# EAGLE design buck_converters_v1.1 (EAGLE 9.6.2)

## Sheet 1 of 2
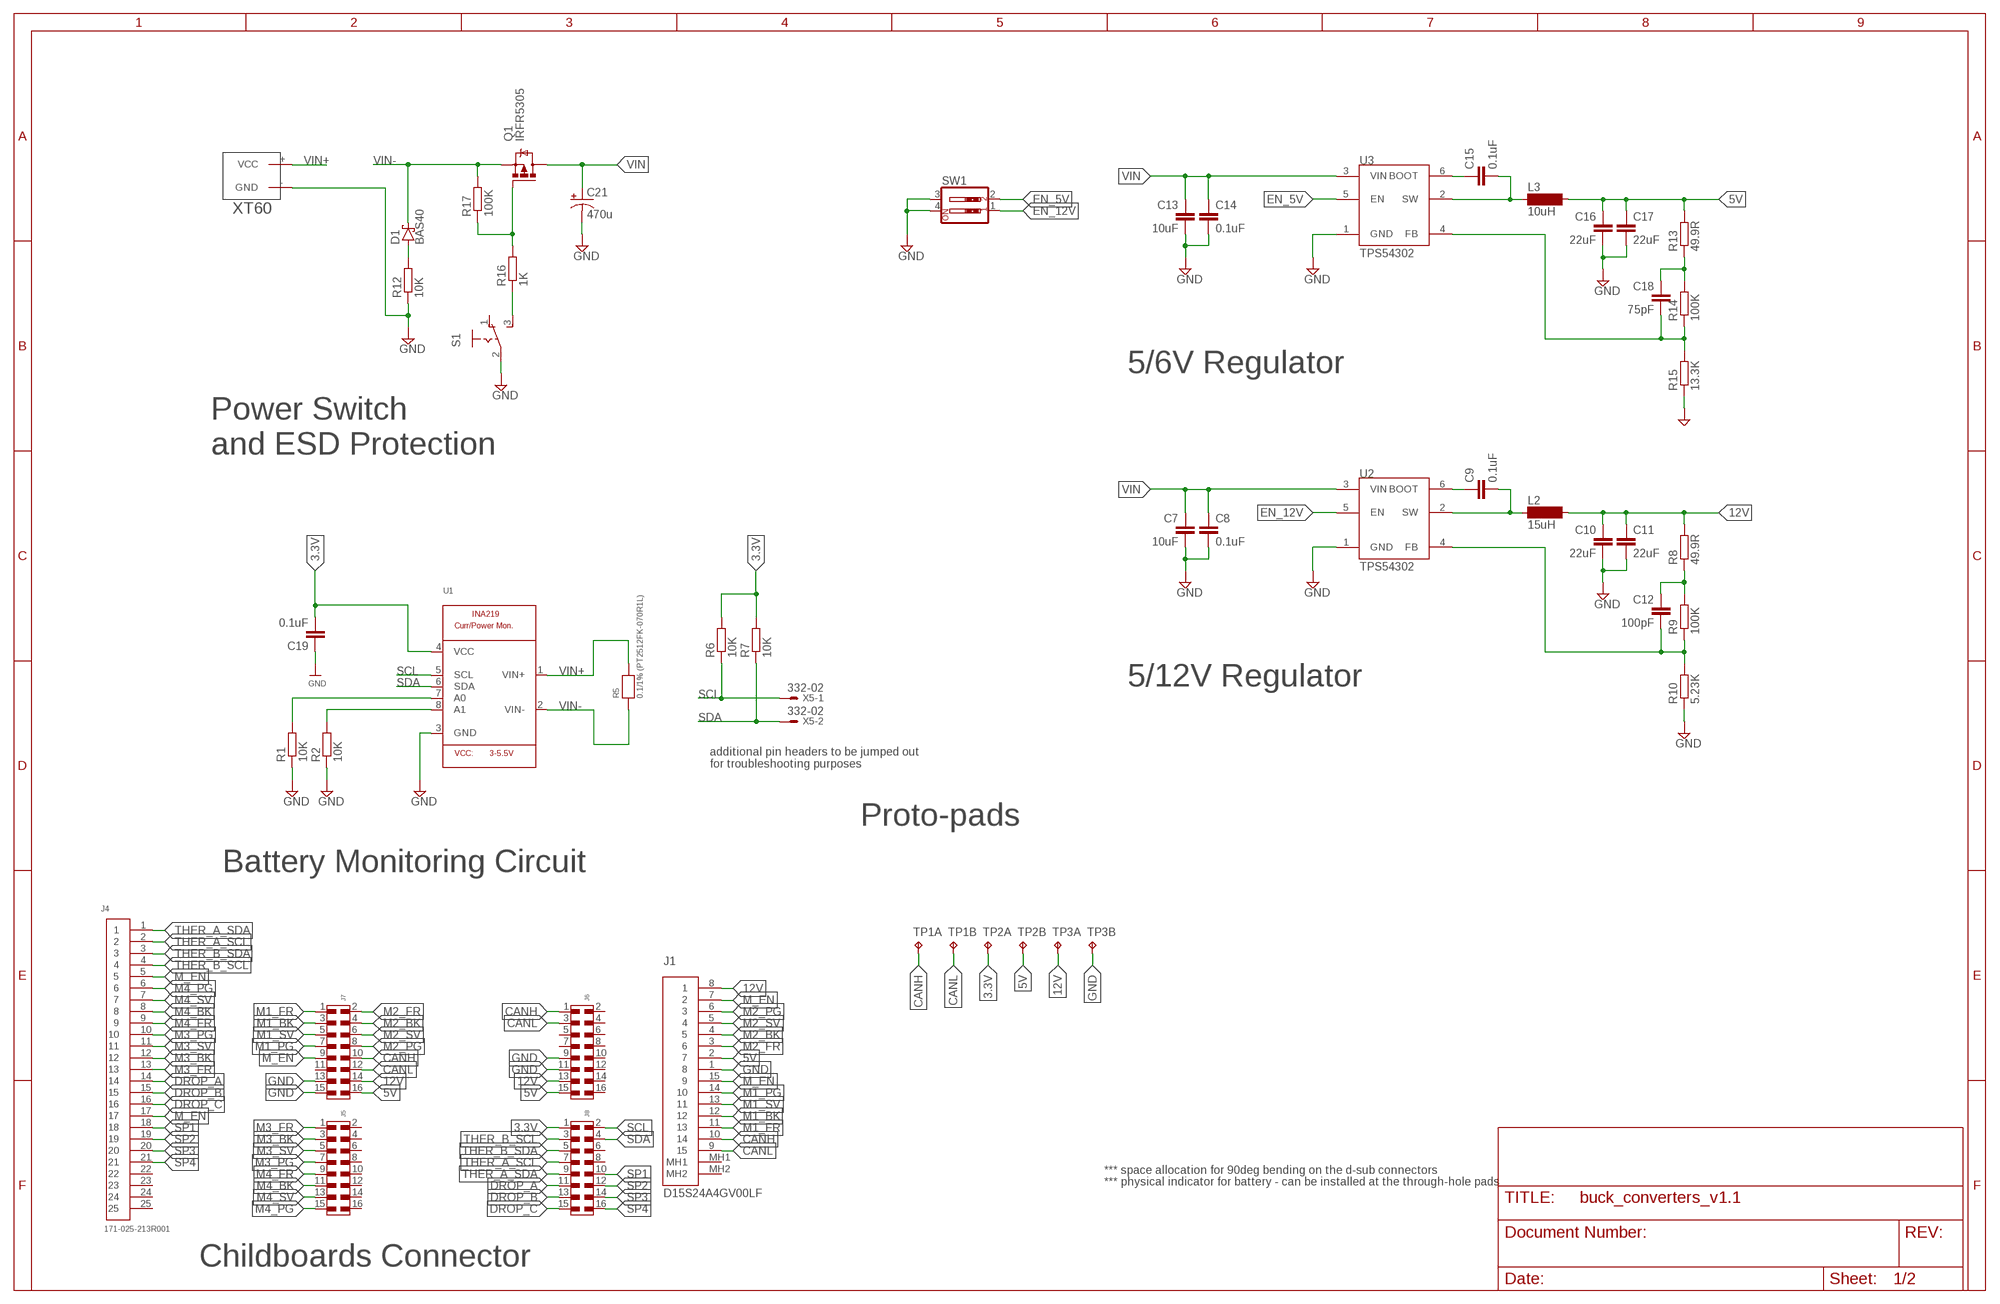
[diagram p0: schematic, sheet 1]

### Parts
C7  10uF  C-EUC0805  [C0805]
C8  0.1uF  C-EUC0805  [C0805]
C9  0.1uF  C-EUC0805  [C0805]
C10  22uF  C-EUC0805  [C0805]
C11  22uF  C-EUC0805  [C0805]
C12  100pF  C-EUC0805  [C0805]
C13  10uF  C-EUC0805  [C0805]
C14  0.1uF  C-EUC0805  [C0805]
C15  0.1uF  C-EUC0805  [C0805]
C16  22uF  C-EUC0805  [C0805]
C17  22uF  C-EUC0805  [C0805]
C18  75pF  C-EUC0805  [C0805]
C19  0.1uF  C-EUC0805  [C0805]
C21  470u  CPOL-US153CLV-1010  [153CLV-1010]
D1  BAS40  [SOT23]
J1  D15S24A4GV00LF  [D15S24A4GV00LF]
J4  171-025-213R001  [171-025-213R001]
J5  6120XX20621_61201620621  [61201620621]
J6  6120XX20621_61201620621  [61201620621]
J7  6123XX20621_61231620621  [61231620621]
J8  6120XX20621_61201620621  [61201620621]
L2  15uH  SM-NE29  [SM-NE29]
L3  10uH  SM-NE29  [SM-NE29]
Q1  IRFR5305  [D-PAK_TO252AA]
R1  10K  R-EU_R0805  [R0805]
R2  10K  R-EU_R0805  [R0805]
R5  0.1/1% (PT2512FK-070R1L)  RESISTOR2512  [2512]
R6  10K  R-EU_R0805  [R0805]
R7  10K  R-EU_R0805  [R0805]
R8  49.9R  R-EU_R0805  [R0805]
R9  100K  R-EU_R0805  [R0805]
R10  5.23K  R-EU_R0805  [R0805]
R12  10K  R-EU_R0805  [R0805]
R13  49.9R  R-EU_R0805  [R0805]
R14  100K  R-EU_R0805  [R0805]
R15  13.3K  R-EU_R0805  [R0805]
R16  1K  R-EU_R0805  [R0805]
R17  100K  R-EU_R0805  [R0805]
S1  255SB  [255SB]
SW1  SW_DIP-2  [EDG-02]
TP1  TP2P2-38-17  [P2-38-17]
TP2  TP2P2-38-17  [P2-38-17]
TP3  TP2P2-38-17  [P2-38-17]
U1  INA219  [SOT23-8]
U2  TPS54302  [SOT23-6]
U3  TPS54302  [SOT23-6]
U$9  XT60  [XT60]
X5  332-02  [332-02]

### Nets
3.3V: C19.2 J8.1 R6.2 R7.2 TP2.TP-1 U1.4(VCC) ; also sheet 2
5V: C16.1 C17.1 J1.2 J6.15 J7.16 L3.2 R13.2 TP2.TP-2 ; also sheet 2
12V: C10.1 C11.1 J1.8 J6.13 J7.14 L2.2 R8.2 TP3.TP-1 ; also sheet 2
CANH: J1.10 J6.1 J7.10 TP1.TP-1 ; also sheet 2
CANL: J1.9 J6.3 J7.12 TP1.TP-2 ; also sheet 2
DROP_A: J4.14 J8.11 ; also sheet 2
DROP_B: J4.15 J8.13 ; also sheet 2
DROP_C: J4.16 J8.15 ; also sheet 2
EN_5V: SW1.2 U3.5(EN)
EN_12V: SW1.1 U2.5(EN)
GND: C7.2 C8.2 C10.2 C11.2 C13.2 C14.2 C16.2 C17.2 C19.1 C21.- J1.1 J6.9 J6.11 J7.13 J7.15 R1.1 R2.1 R10.1 R12.1 R15.1 S1.2(P) SW1.3 SW1.4 TP3.TP-2 U1.3(GND) U2.1(GND) U3.1(GND) U$9.-(GND) ; also sheet 2
M1_BK: J1.12 J7.3 ; also sheet 2
M1_FR: J1.11 J7.1 ; also sheet 2
M1_PG: J1.14 J7.7 ; also sheet 2
M1_SV: J1.13 J7.5 ; also sheet 2
M2_BK: J1.4 J7.4 ; also sheet 2
M2_FR: J1.3 J7.2 ; also sheet 2
M2_PG: J1.6 J7.8 ; also sheet 2
M2_SV: J1.5 J7.6 ; also sheet 2
M3_BK: J4.12 J5.3 ; also sheet 2
M3_FR: J4.13 J5.1 ; also sheet 2
M3_PG: J4.10 J5.7 ; also sheet 2
M3_SV: J4.11 J5.5 ; also sheet 2
M4_BK: J4.8 J5.11 ; also sheet 2
M4_FR: J4.9 J5.9 ; also sheet 2
M4_PG: J4.6 J5.15 ; also sheet 2
M4_SV: J4.7 J5.13 ; also sheet 2
M_EN: J1.7 J1.15 J4.5 J4.17 J7.9 ; also sheet 2
N$3: R2.2 U1.8(A1)
N$6: C12.1 R8.1 R9.2
N$7: C12.2 R9.1 R10.2 U2.4(FB)
N$8: R1.2 U1.7(A0)
N$9: C9.1 U2.6(BOOT)
N$10: C9.2 L2.1 U2.2(SW)
N$11: C18.1 R13.1 R14.2
N$12: C18.2 R14.1 R15.2 U3.4(FB)
N$14: C15.1 U3.6(BOOT)
N$15: C15.2 L3.1 U3.2(SW)
N$16: D1.1(A) R12.2
N$17: R16.1 S1.3(S)
N$18: Q1.1(G) R16.2 R17.1
SCL: J8.2 R6.1 U1.5(SCL) X5.1 ; also sheet 2
SDA: J8.4 R7.1 U1.6(SDA) X5.2 ; also sheet 2
SP1: J4.18 J8.10 ; also sheet 2
SP2: J4.19 J8.12 ; also sheet 2
SP3: J4.20 J8.14 ; also sheet 2
SP4: J4.21 J8.16 ; also sheet 2
THER_A_SCL: J4.2 J8.7 ; also sheet 2
THER_A_SDA: J4.1 J8.9 ; also sheet 2
THER_B_SCL: J4.4 J8.3 ; also sheet 2
THER_B_SDA: J4.3 J8.5 ; also sheet 2
VIN: C7.1 C8.1 C13.1 C14.1 C21.+ Q1.4(D) U2.3(VIN) U3.3(VIN)
VIN+: R5.2 U1.1(VIN+) U$9.+(VCC)
VIN-: D1.3(C) Q1.3(S) R5.1 R17.2 U1.2(VIN-)
Unconnected: J1.MH1 J1.MH2 J4.22 J4.23 J4.24 J4.25 J5.2 J5.4 J5.6 J5.8 J5.10 J5.12 J5.14 J5.16 J6.2 J6.4 J6.5 J6.6 J6.7 J6.8 J6.10 J6.12 J6.14 J6.16 J7.11 J8.6 J8.8 S1.1(O)

### Notes on the sheet
- 5/6V Regulator
- Power Switch
  and ESD Protection
- 5/12V Regulator
- additional pin headers to be jumped out 
  for troubleshooting purposes
- Proto-pads
- Battery Monitoring Circuit
- *** space allocation for 90deg bending on the d-sub connectors
- *** physical indicator for battery - can be installed at the through-hole pads
- Childboards Connector

## Sheet 2 of 2
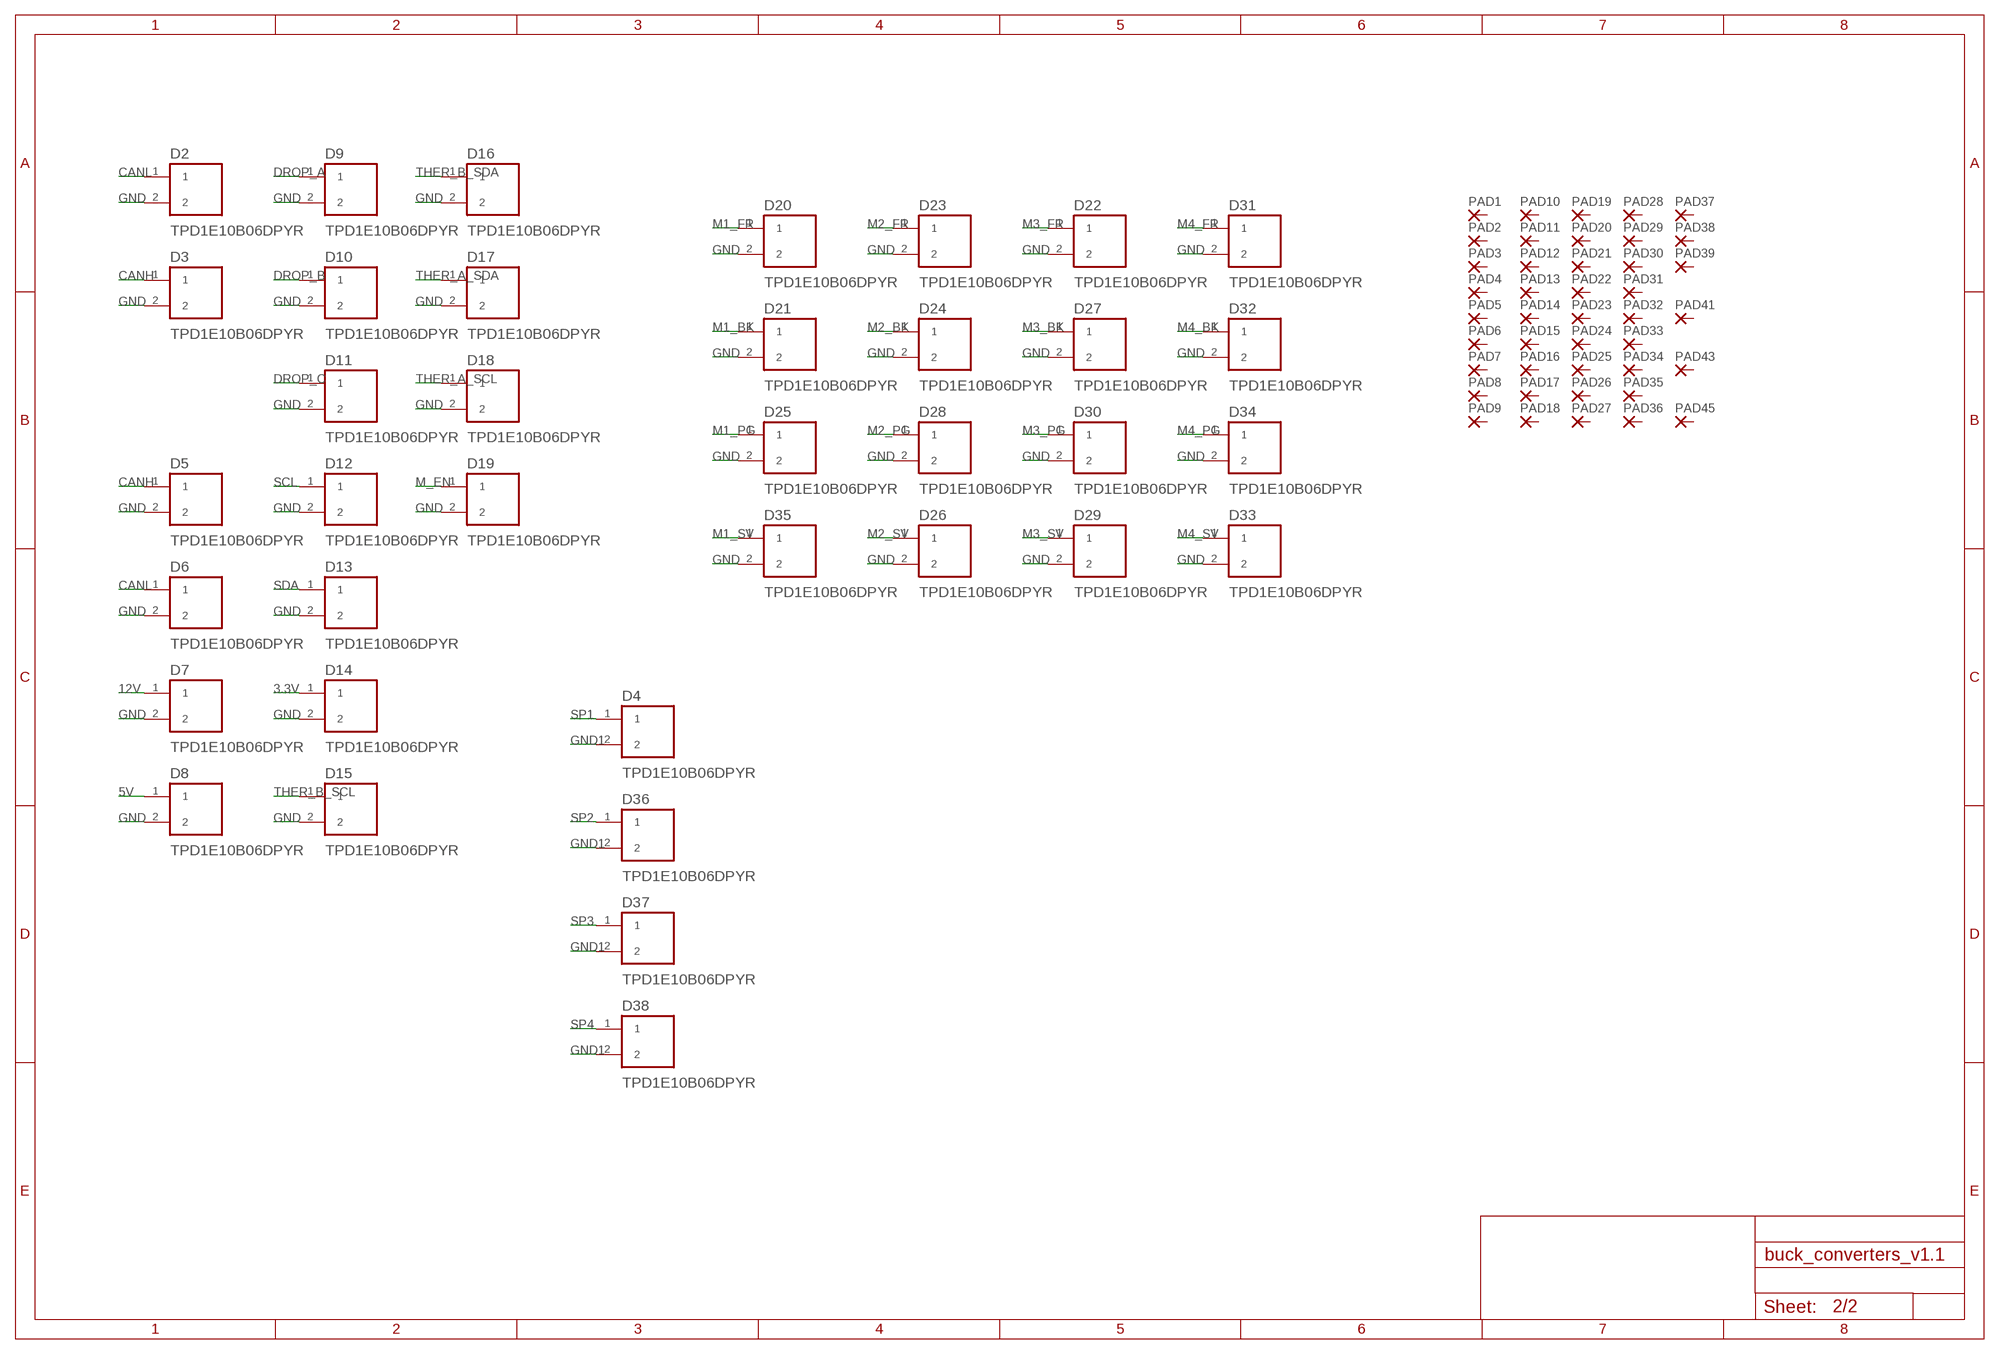
[diagram p1: schematic, sheet 2]

### Parts
D2  TPD1E10B06DPYR  [DIO_TPD1E05U06DPYR]
D3  TPD1E10B06DPYR  [DIO_TPD1E05U06DPYR]
D4  TPD1E10B06DPYR  [DIO_TPD1E05U06DPYR]
D5  TPD1E10B06DPYR  [DIO_TPD1E05U06DPYR]
D6  TPD1E10B06DPYR  [DIO_TPD1E05U06DPYR]
D7  TPD1E10B06DPYR  [DIO_TPD1E05U06DPYR]
D8  TPD1E10B06DPYR  [DIO_TPD1E05U06DPYR]
D9  TPD1E10B06DPYR  [DIO_TPD1E05U06DPYR]
D10  TPD1E10B06DPYR  [DIO_TPD1E05U06DPYR]
D11  TPD1E10B06DPYR  [DIO_TPD1E05U06DPYR]
D12  TPD1E10B06DPYR  [DIO_TPD1E05U06DPYR]
D13  TPD1E10B06DPYR  [DIO_TPD1E05U06DPYR]
D14  TPD1E10B06DPYR  [DIO_TPD1E05U06DPYR]
D15  TPD1E10B06DPYR  [DIO_TPD1E05U06DPYR]
D16  TPD1E10B06DPYR  [DIO_TPD1E05U06DPYR]
D17  TPD1E10B06DPYR  [DIO_TPD1E05U06DPYR]
D18  TPD1E10B06DPYR  [DIO_TPD1E05U06DPYR]
D19  TPD1E10B06DPYR  [DIO_TPD1E05U06DPYR]
D20  TPD1E10B06DPYR  [DIO_TPD1E05U06DPYR]
D21  TPD1E10B06DPYR  [DIO_TPD1E05U06DPYR]
D22  TPD1E10B06DPYR  [DIO_TPD1E05U06DPYR]
D23  TPD1E10B06DPYR  [DIO_TPD1E05U06DPYR]
D24  TPD1E10B06DPYR  [DIO_TPD1E05U06DPYR]
D25  TPD1E10B06DPYR  [DIO_TPD1E05U06DPYR]
D26  TPD1E10B06DPYR  [DIO_TPD1E05U06DPYR]
D27  TPD1E10B06DPYR  [DIO_TPD1E05U06DPYR]
D28  TPD1E10B06DPYR  [DIO_TPD1E05U06DPYR]
D29  TPD1E10B06DPYR  [DIO_TPD1E05U06DPYR]
D30  TPD1E10B06DPYR  [DIO_TPD1E05U06DPYR]
D31  TPD1E10B06DPYR  [DIO_TPD1E05U06DPYR]
D32  TPD1E10B06DPYR  [DIO_TPD1E05U06DPYR]
D33  TPD1E10B06DPYR  [DIO_TPD1E05U06DPYR]
D34  TPD1E10B06DPYR  [DIO_TPD1E05U06DPYR]
D35  TPD1E10B06DPYR  [DIO_TPD1E05U06DPYR]
D36  TPD1E10B06DPYR  [DIO_TPD1E05U06DPYR]
D37  TPD1E10B06DPYR  [DIO_TPD1E05U06DPYR]
D38  TPD1E10B06DPYR  [DIO_TPD1E05U06DPYR]
PAD1  2,54/1,1  [2,54/1,1]
PAD2  2,54/1,1  [2,54/1,1]
PAD3  2,54/1,1  [2,54/1,1]
PAD4  2,54/1,1  [2,54/1,1]
PAD5  2,54/1,1  [2,54/1,1]
PAD6  2,54/1,1  [2,54/1,1]
PAD7  2,54/1,1  [2,54/1,1]
PAD8  2,54/1,1  [2,54/1,1]
PAD9  2,54/1,1  [2,54/1,1]
PAD10  2,54/1,1  [2,54/1,1]
PAD11  2,54/1,1  [2,54/1,1]
PAD12  2,54/1,1  [2,54/1,1]
PAD13  2,54/1,1  [2,54/1,1]
PAD14  2,54/1,1  [2,54/1,1]
PAD15  2,54/1,1  [2,54/1,1]
PAD16  2,54/1,1  [2,54/1,1]
PAD17  2,54/1,1  [2,54/1,1]
PAD18  2,54/1,1  [2,54/1,1]
PAD19  2,54/1,1  [2,54/1,1]
PAD20  2,54/1,1  [2,54/1,1]
PAD21  2,54/1,1  [2,54/1,1]
PAD22  2,54/1,1  [2,54/1,1]
PAD23  2,54/1,1  [2,54/1,1]
PAD24  2,54/1,1  [2,54/1,1]
PAD25  2,54/1,1  [2,54/1,1]
PAD26  2,54/1,1  [2,54/1,1]
PAD27  2,54/1,1  [2,54/1,1]
PAD28  2,54/1,1  [2,54/1,1]
PAD29  2,54/1,1  [2,54/1,1]
PAD30  2,54/1,1  [2,54/1,1]
PAD31  2,54/1,1  [2,54/1,1]
PAD32  2,54/1,1  [2,54/1,1]
PAD33  2,54/1,1  [2,54/1,1]
PAD34  2,54/1,1  [2,54/1,1]
PAD35  2,54/1,1  [2,54/1,1]
PAD36  2,54/1,1  [2,54/1,1]
PAD37  2,54/1,1  [2,54/1,1]
PAD38  2,54/1,1  [2,54/1,1]
PAD39  2,54/1,1  [2,54/1,1]
PAD41  2,54/1,1  [2,54/1,1]
PAD43  2,54/1,1  [2,54/1,1]
PAD45  2,54/1,1  [2,54/1,1]

### Nets
3.3V: D14.1 ; also sheet 1
5V: D8.1 ; also sheet 1
12V: D7.1 ; also sheet 1
CANH: D3.1 D5.1 ; also sheet 1
CANL: D2.1 D6.1 ; also sheet 1
DROP_A: D9.1 ; also sheet 1
DROP_B: D10.1 ; also sheet 1
DROP_C: D11.1 ; also sheet 1
GND: D2.2 D3.2 D5.2 D6.2 D7.2 D8.2 D9.2 D10.2 D11.2 D12.2 D13.2 D14.2 D15.2 D16.2 D17.2 D18.2 D19.2 D20.2 D21.2 D22.2 D23.2 D24.2 D25.2 D26.2 D27.2 D28.2 D29.2 D30.2 D31.2 D32.2 D33.2 D34.2 D35.2 ; also sheet 1
GND1: D4.2 D36.2 D37.2 D38.2
M1_BK: D21.1 ; also sheet 1
M1_FR: D20.1 ; also sheet 1
M1_PG: D25.1 ; also sheet 1
M1_SV: D35.1 ; also sheet 1
M2_BK: D24.1 ; also sheet 1
M2_FR: D23.1 ; also sheet 1
M2_PG: D28.1 ; also sheet 1
M2_SV: D26.1 ; also sheet 1
M3_BK: D27.1 ; also sheet 1
M3_FR: D22.1 ; also sheet 1
M3_PG: D30.1 ; also sheet 1
M3_SV: D29.1 ; also sheet 1
M4_BK: D32.1 ; also sheet 1
M4_FR: D31.1 ; also sheet 1
M4_PG: D34.1 ; also sheet 1
M4_SV: D33.1 ; also sheet 1
M_EN: D19.1 ; also sheet 1
SCL: D12.1 ; also sheet 1
SDA: D13.1 ; also sheet 1
SP1: D4.1 ; also sheet 1
SP2: D36.1 ; also sheet 1
SP3: D37.1 ; also sheet 1
SP4: D38.1 ; also sheet 1
THER_A_SCL: D18.1 ; also sheet 1
THER_A_SDA: D17.1 ; also sheet 1
THER_B_SCL: D15.1 ; also sheet 1
THER_B_SDA: D16.1 ; also sheet 1
Unconnected: PAD1.1(P) PAD2.1(P) PAD3.1(P) PAD4.1(P) PAD5.1(P) PAD6.1(P) PAD7.1(P) PAD8.1(P) PAD9.1(P) PAD10.1(P) PAD11.1(P) PAD12.1(P) PAD13.1(P) PAD14.1(P) PAD15.1(P) PAD16.1(P) PAD17.1(P) PAD18.1(P) PAD19.1(P) PAD20.1(P) PAD21.1(P) PAD22.1(P) PAD23.1(P) PAD24.1(P) PAD25.1(P) PAD26.1(P) PAD27.1(P) PAD28.1(P) PAD29.1(P) PAD30.1(P) PAD31.1(P) PAD32.1(P) PAD33.1(P) PAD34.1(P) PAD35.1(P) PAD36.1(P) PAD37.1(P) PAD38.1(P) PAD39.1(P) PAD41.1(P) PAD43.1(P) PAD45.1(P)

## Library data of the parts
C7-C19 = rcl:C-EU: CAPACITOR, European symbol; SPICEPREFIX: C
C21 = rcl:CPOL-US: POLARIZED CAPACITOR, American symbol; SPICEPREFIX: C
D1 = diode:BAS40: Silicon Schottky Diodes General-purpose diode for high-speed switching
D2-D38 = TPD1E10B06DPYR:TPD1E10B06DPYR: Check prices <https://pricing.snapeda.com/parts/TPD1E10B06DPYR/Texas%20Instruments/view-part?ref=eda>; AVAILABILITY: Warning; DESCRIPTION: Single-channel ESD in 0402 package with 10pF capacitance and 6-V breakdown 2-X1SON -40 to 125; MF: Texas Instruments; MP: TPD1E10B06DPYR; PACKAGE: X1SON-2 Texas Instruments; PRICE: None; PURCHASE-URL: https://pricing.snapeda.com/search/part/TPD1E10B06DPYR/?ref=eda
J1 = D-Sub Connectors:D15S24A4GV00LF: CONN D-SUB RCPT 15POS VERT SLDR Manufacturer's datasheet <https://www.amphenol-icc.com/media/wysiwyg/files/drawing/c01-8646-0815.pdf>; CREATED_BY: PCBLayout.com; DIGIKEY_PART_NUMBER: 609-1497-ND; MANUFACTURER: Amphenol ICC (FCI); MPN: D15S24A4GV00LF
J4 = D-Sub Connectors:171-025-213R001: CONN D-SUB RCPT 25P PNL MNT SLDR Manufacturer's datasheet <https://www.norcomp.net/rohspdfs/Connectors/17Y/171/171-YYY-213RYY1.pdf>; CREATED_BY: PCBLayout.com; DIGIKEY_PART_NO: 4225FE-ND; MANUFACTURER: NorComp Inc.; MPN: 171-025-213R001
J5 J6 J8 = smt_male_header_16ways:6120XX20621_61201620621: WR-BHD 2.54 mm Male SMT Box Header KIND PROPERTIES: Pitch 2.54 mm Gender:Male MATERIAL PROPERTIES: Insulator Material:PA6T Insulator Flammability Rating UL94 V-0 Insulator Color:Black Contact Material :Copper Alloy Contact Plating :Gold Contact Type: Stamped GENERAL INFORMATION: Operating Temperature:-40 °C up to +125 °C Compliance:RoHS Working Voltage: 250 V (AC) Withstanding Voltage:500 V (AC) Contact Resistance: 20 mΩ Insulation Resistance:1000 MΩ CERTIFICATION: UL Approval:E323964 PACKAGING PROPERTIES Packaging :Tube <https://katalog.we-online.com/media/images/v2/o32919v209%20Family_WR-BHD_612xxx20621.jpg> Details see: https://katalog.we-online.com/en/em/BHD_2_54_SMT_MALE_BOX_HEADER_6120XX20621 Updated by Yingchun,Shan 2019-10-30 2019 (C) Würth Elektronik; CONTACT-RESISTANCE: 20mOhm; DATASHEET-URL: https://katalog.we-online.com/em/datasheet/61201620621.pdf; GENDER: Male; IR: 3A; L: 28.12mm; MOUNT: SMT; PACKAGING: Tube; PART-NUMBER: 61201620621; PINS: 16; PITCH: 2.54mm; TOL-R: max.; TYPE: Straight; WORKING-VOLTAGE: 250V(AC)
J7 = smt_male_header_16ways:6123XX20621_61231620621: 2.54 mm Male SMT Box Header (Reel) KIND PROPERTIES: Pitch 2.54 mm Gender:Male MATERIAL PROPERTIES: Insulator Material:PA6T Insulator Flammability Rating UL94 V-0 Insulator Color:Black Contact Material :Copper Alloy Contact Plating :Gold Contact Type: Stamped GENERAL INFORMATION: Operating Temperature:-40 °C up to +125 °C Compliance:RoHS Working Voltage: 250 V (AC) Withstanding Voltage:500 V (AC) Contact Resistance: 20 mΩ Insulation Resistance:1000 MΩ CERTIFICATION UL Approval:E323964 PACKAGING PROPERTIES Packaging :Tape and Reel with Cap <https://katalog.we-online.com/media/images/v2/o58841v209%20Family_2.54mm_WR-BHD_612xxx20621.jpg> Details see: https://katalog.we-online.com/en/em/BHD_2_54_SMT_MALE_BOX_HEADER_REEL_6123XX20621 Updated by Yingchun,Shan 2019-10-30 2019 (C) Würth Elektronik; CONTACT-RESISTANCE: 20mOhm; DATASHEET-URL: https://katalog.we-online.com/em/datasheet/61231620621.pdf; GENDER: Male; IR: 3A; L: 28.12mm; MOUNT: SMT; PACKAGING: Tape and Reel with Cap; PART-NUMBER: 61231620621; PINS: 16; PITCH: 2.54mm; TOL-R: max.; TYPE: Straight; WORKING-VOLTAGE: 250V(AC)
L2 L3 = inductor-neosid:SM-NE29: INDUCTOR SMD chip inductor; OC_FARNELL: unknown; OC_NEWARK: unknown
PAD1-PAD39 PAD41 PAD43 PAD45 = wirepad:2,54/1,1: THROUGH-HOLE PAD
Q1 = transistor-power:IRF?5305: HEXFET Power MOSFET Source: http://www.irf.com/product-info/datasheets/data/irfr5305pbf.pdf
R1 R2 R6-R10 R12-R17 = rcl:R-EU_: RESISTOR, European symbol; SPICEPREFIX: R
R5 = microbuilder:RESISTOR: Resistors 0402 - 0402 Surface Mount Package 22 Ohm 1% 1/16W [Digikey: 311-22.0LRTR-ND] 33 Ohm 5% 1/16W 1.0K 5% 1/16W 1.5K 5% 1/16W 2.0K 1% 1/16W 10.0K 1% 1/16W [Digikey: 311-10.0KLRTR-ND] 10.0K 5% 1/16W [Digikey: RMCF0402JT10K0TR-ND] 12.1K 1% 1/16W [Digikey: 311-22.0LRTR-ND] 100.0K 5% 1/16W 0603 - 0603 Surface Mount Package 0 Ohm 1/10 Watt 1% Resistor 15 Ohm 1/10 Watt 1% Resistor 33 Ohm 1/10 Watt 1% Resistor 49.9 Ohm 1/10 Watt 1% Resistor 100 Ohm 1/10 Watt 1% Resistor 150 Ohm 1/10 Watt 1% Resistor 240 Ohm 1/10 Watt 1% Resistor 390 Ohm 1/10 Watt 1% Resistor 560 Ohm 1/10 Watt 1% Resistor 680 Ohm 1/10 Watt 1% Resistor 750 Ohm 1/10 Watt 1% Resistor 1.0K Ohm 1/10 Watt 1% Resistor 1.5K Ohm 1/10 Watt 1% Resistor 2.0K Ohm 1/10 Watt 1% Resistor 2.2K Ohm 1/10 Watt 1% Resistor 3.3K Ohm 1/10 Watt 1% Resistor 4.7K Ohm 1/10 Watt 1% Resistor 10.0K Ohm 1/10 Watt 1% Resistor 12.0K Ohm 1/10 Watt 1% Resistor 12.1K Ohm 1/10 Watt 1% Resistor 20.0K Ohm 1/10 Watt 1% Resistor 33.0K Ohm 1/10 Watt 1% Resistor 100.0K Ohm 1/10 Watt 1% Resistor 0805 - 0805 Surface Mount Package 0 Ohm 1/8 Watt 1% Resistor 33 Ohm 1/8 Watt 1% Resistor 100 Ohm 1/8 Watt 1% Resistor 150 Ohm 1/8 Watt 1% Resistor 200 Ohm 1/8 Watt 1% Resistor 240 Ohm 1/8 Watt 1% Resistor 330 Ohm 1/8 Watt 1% Resistor 390 Ohm 1/8 Watt 1% Resistor 470 Ohm 1/8 Watt 1% Resistor 1.0K Ohm 1/8 Watt 1% Resistor 1.5K Ohm 1/8 Watt 1% Resistor 2.0K Ohm 1/8 Watt 1% Resistor 4.7K Ohm 1/8 Watt 1% Resistor 5.1K Ohm 1/8 Watt 1% Resistor 5.6K Ohm 1/8 Watt 1% Resistor 10.0K Ohm 1/8 Watt 1% Resistor 22.0K Ohm 1/8 Watt 1% Resistor 33.0K Ohm 1/8 Watt 1% Resistor 100K Ohm 1/8 Watt 1% Resistor 1206 - 1206 Surface Mount Package 2012 - 2010 Surface Mount Package 0.11 Ohm 1/2 Watt 1% Resistor - Digikey: RHM.11UCT-ND
S1 = switch:255SB: SLIDING SWITCH Distributor Buerklin, 11G810
SW1 = special:SW_DIP-2: DIP SWITCH
TP1-TP3 = testpad:TP2: Test pad
U1 = INA219:INA219: INA219 - I2C Current/Power Monitor Voltage Range: 0-26V Accuracy: 0.5% Temperature: -40°C - 125°C
U2 U3 = TPSxxxxxx-buck-regulators:TPS54302
U$9 = XT60:XT60: XT60
X5 = con-garry:332-02: 2 Pin - 2mm Dual Row Source: www.mpe-connector.de / garry_shortform_2012.pdf

## Board
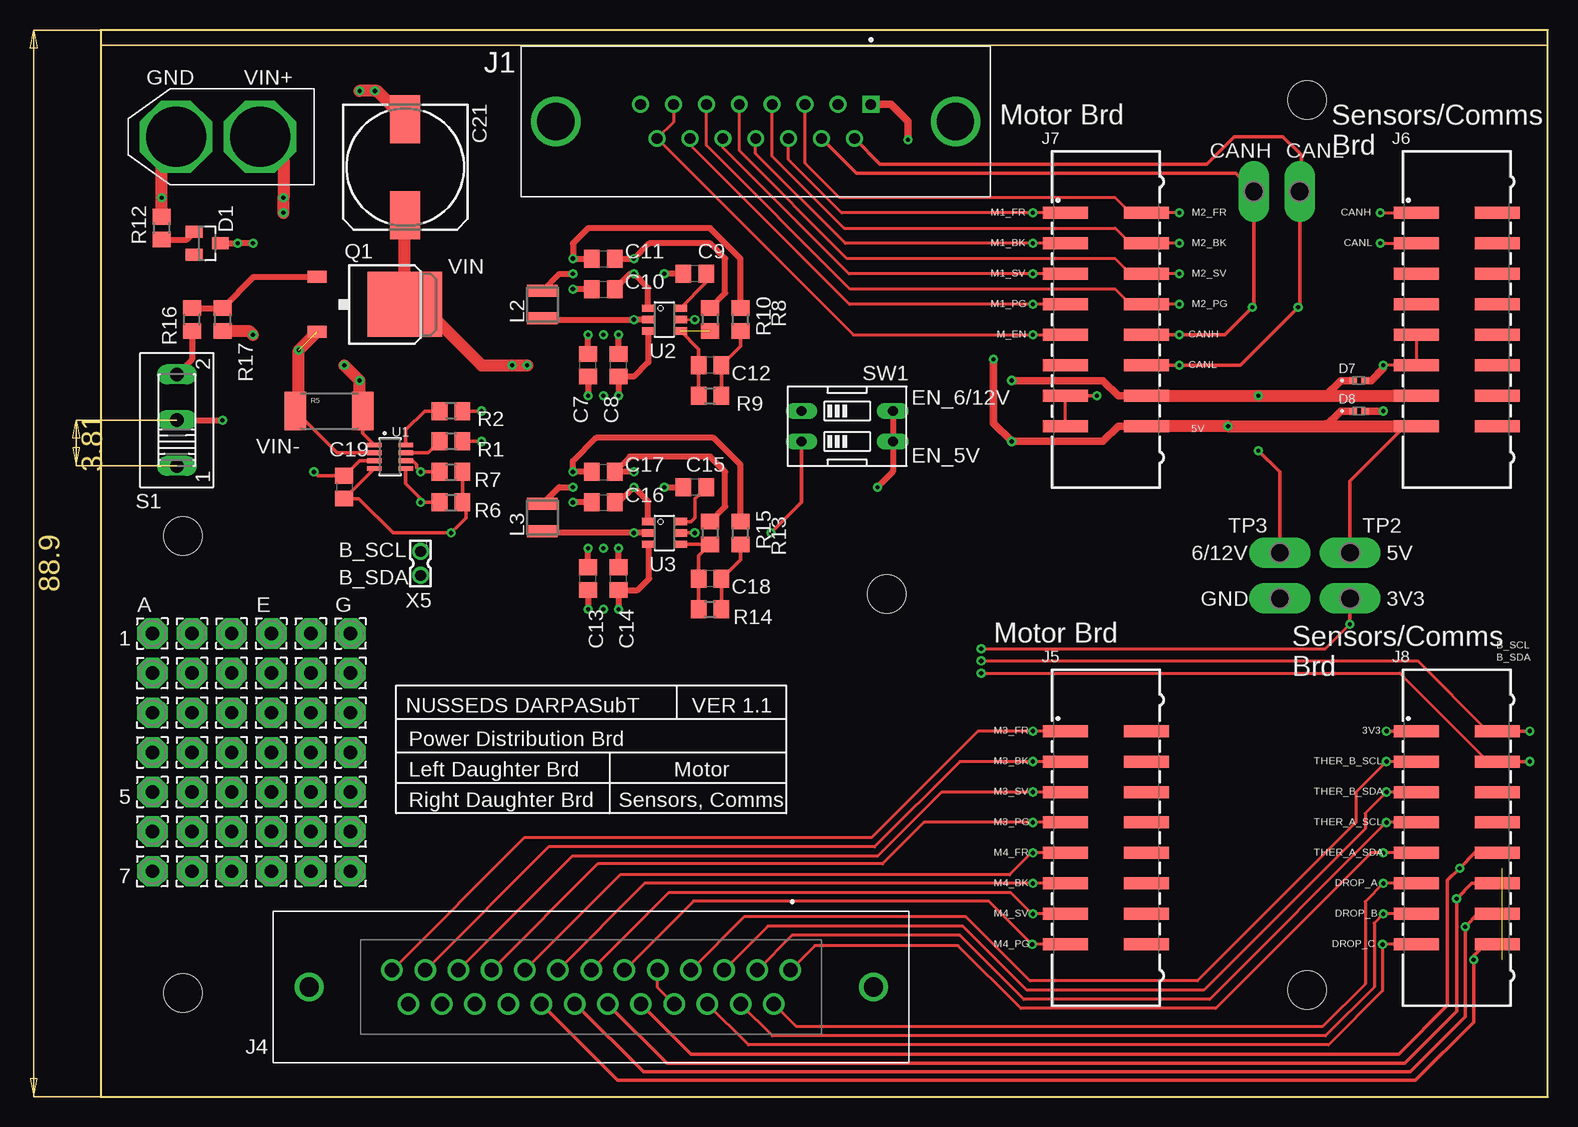
[diagram p2: board, top side]
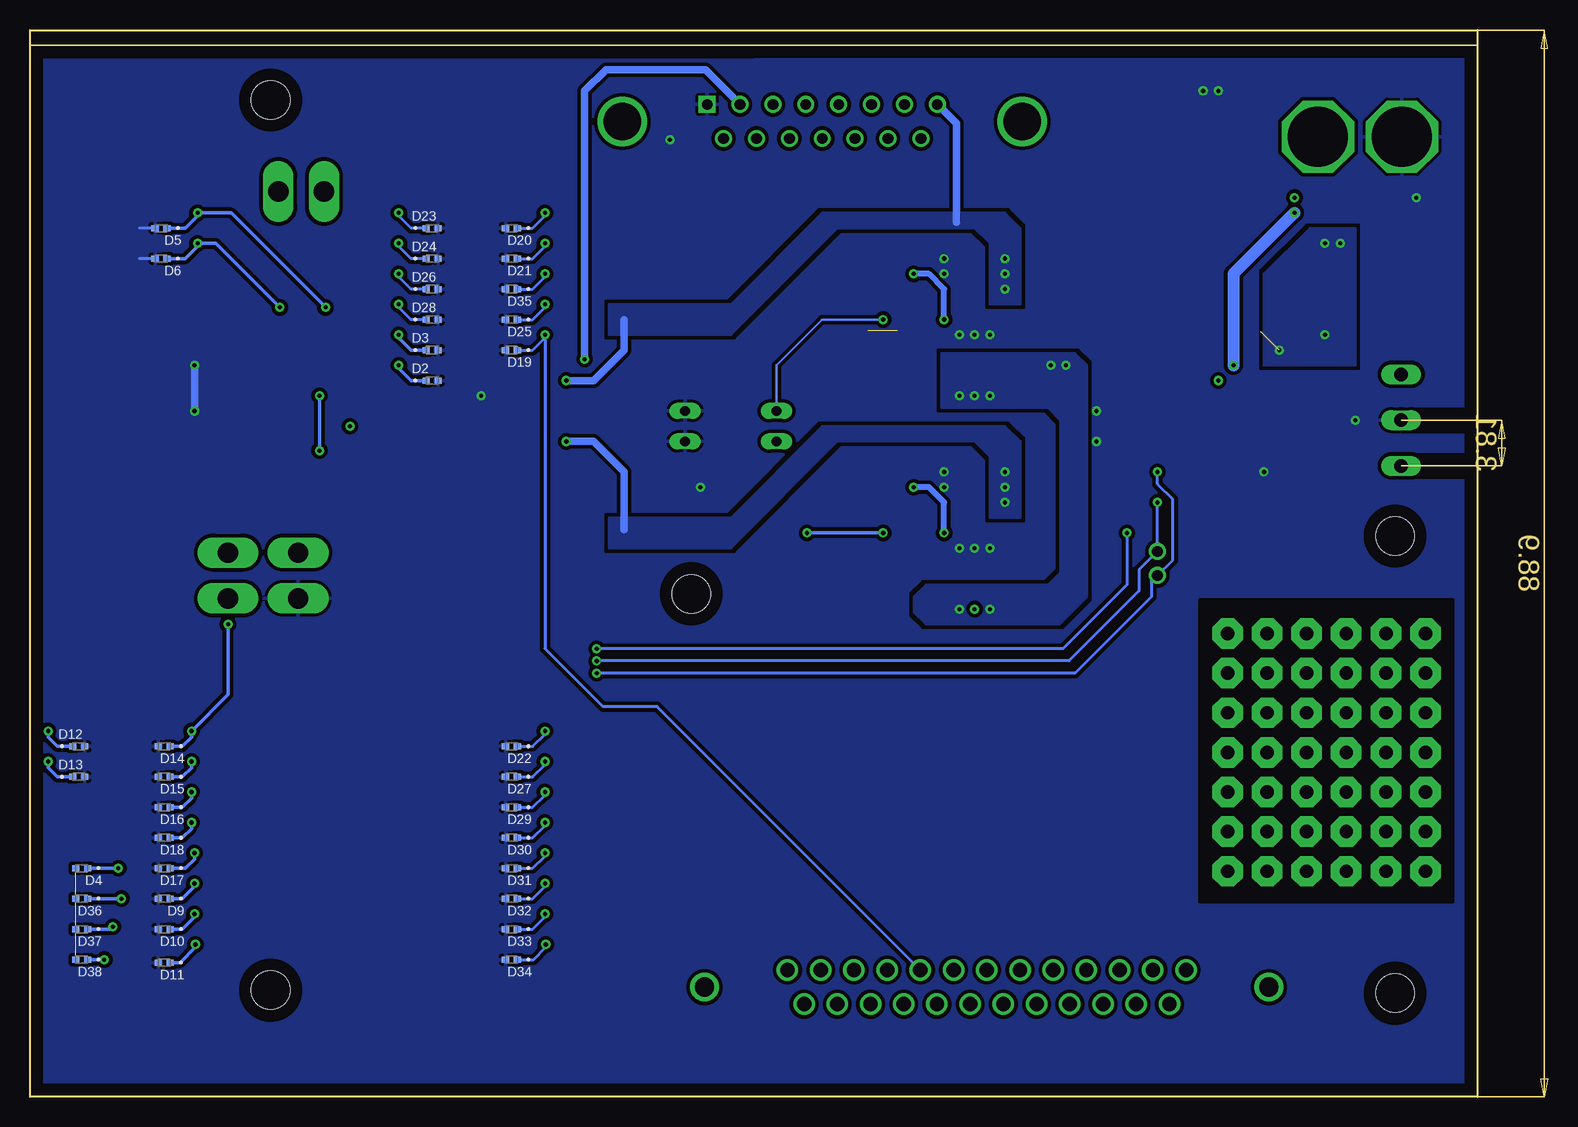
[diagram p3: board, bottom side, seen from below]

Size 120.65 x 88.9 mm. Coordinates in mm from the lower left corner, seen from the top.
Outline: 0,88.9 0,0 120.65,0 120.65,88.9 0,88.9
Copper layers (1*16): Top 0.035mm / dielectric 1.5mm / Bottom 0.035mm
Design rules "default": minimum track width 6mil, minimum drill 0.35mm, track to track 6mil, track to pad 6mil, pad to pad 6mil, via to via 6mil, smd to smd 6mil, copper to edge 40mil, drill to drill 6mil, minimum pad ring 10mil, minimum via ring 8mil, stop-mask expansion 4mil, vias tented up to drill 0mil, thermal gap 10mil
Holes 3.2 mm at 6.86,46.74 6.86,8.64 100.58,8.89 100.58,83.06 65.53,41.91

### Footprints (pad centres in the part's own frame; a part is rotated, then mirrored left to right if it is on the bottom)
C0805 = smd 1.3 x 1.5: 1 -0.95,0; 2 0.95,0
153CLV-1010 = smd 4 x 2.5: + 4,0; - -4,0
SOT23 = smd 1 x 1.4: 1 -0.95,-1.1; 2 0.95,-1.1; 3 0,1.1
DIO_TPD1E05U06DPYR = smd 0.6 x 0.5: 1 -0.5,0; 2 0.5,0
D15S24A4GV00LF = drill 0.9 square: 1 9.59,1.42 | drill 0.9: 2 6.85,1.42; 3 4.11,1.42; 4 1.37,1.42; 5 -1.37,1.42; 6 -4.11,1.42; 7 -6.85,1.42; 8 -9.59,1.42; 9 8.22,-1.42; 10 5.48,-1.42; 11 2.74,-1.42; 12 0,-1.42; 13 -2.74,-1.42; 14 -5.48,-1.42; 15 -8.22,-1.42 | drill 3.1: MH1 -16.66,0; MH2 16.66,0
171-025-213R001 = drill 1.194: 1 16.612,1.422; 2 13.843,1.422; 3 11.074,1.422; 4 8.306,1.422; 5 5.537,1.422; 6 2.769,1.422; 7 0,1.422; 8 -2.769,1.422; 9 -5.537,1.422; 10 -8.306,1.422; 11 -11.074,1.422; 12 -13.843,1.422; 13 -16.612,1.422; 14 15.227,-1.422; 15 12.459,-1.422; 16 9.69,-1.422; 17 6.921,-1.422; 18 4.153,-1.422; 19 1.384,-1.422; 20 -1.384,-1.422; 21 -4.153,-1.422; 22 -6.921,-1.422; 23 -9.69,-1.422; 24 -12.459,-1.422; 25 -15.227,-1.422 | drill 1.6: P$1 -23.52,0; P$2 23.52,0
61201620621 = smd 1 x 3.75: 1 -8.89,-3.375; 2 -8.89,3.375; 3 -6.35,-3.375; 4 -6.35,3.375; 5 -3.81,-3.375; 6 -3.81,3.375; 7 -1.27,-3.375; 8 -1.27,3.375; 9 1.27,-3.375; 10 1.27,3.375; 11 3.81,-3.375; 12 3.81,3.375; 13 6.35,-3.375; 14 6.35,3.375; 15 8.89,-3.375; 16 8.89,3.375
61231620621 = smd 1 x 3.75: 1 -8.89,-3.375; 2 -8.89,3.375; 3 -6.35,-3.375; 4 -6.35,3.375; 5 -3.81,-3.375; 6 -3.81,3.375; 7 -1.27,-3.375; 8 -1.27,3.375; 9 1.27,-3.375; 10 1.27,3.375; 11 3.81,-3.375; 12 3.81,3.375; 13 6.35,-3.375; 14 6.35,3.375; 15 8.89,-3.375; 16 8.89,3.375
SM-NE29 = smd 1 x 2.54: 1 -1.15,0; 2 1.15,0
2,54/1,1 = drill 1.118 pad 2.54 octagon: 1 0,0
D-PAK_TO252AA = smd 1 x 1.6: 1 -2.28,-4.8; 3 2.28,-4.8 | smd 5.4 x 6.2: 4 0,2.5
R0805 = smd 1.3 x 1.5: 1 -0.95,0; 2 0.95,0
2512 = smd 1.8 x 3.2: 1 -2.8,0; 2 2.8,0
255SB = drill 1.118 long: 1 -3.81,0; 2 0,0; 3 3.81,0
EDG-02 = drill 0.813 long: 1 -1.27,-3.81; 2 1.27,-3.81; 3 1.27,3.81; 4 -1.27,3.81
P2-38-17 = drill 1.702 pad 2.121 long: TP-1 -1.905,0; TP-2 1.905,0
SOT23-8 = smd 0.4 x 1.2: 1 -0.975,-1.3; 2 -0.325,-1.3; 3 0.325,-1.3; 4 0.975,-1.3; 5 0.975,1.3; 6 0.325,1.3; 7 -0.325,1.3; 8 -0.975,1.3
SOT23-6 = smd 0.6 x 1.05: 1 -0.95,-1.35; 2 0,-1.35; 3 0.95,-1.35; 4 0.95,1.35; 5 0,1.35; 6 -0.95,1.35
XT60 = drill 5 octagon: + 4.5,0; - 11.5,0
332-02 = drill 0.9 pad 1.27: 1 0,-1; 2 0,1

### Placement (x,y rotation side)
C7  40.64,60.96 90 top
C8  43.18,60.96 90 top
C9  49.53,68.58 180 top
C10  41.91,67.31 0 top
C11  41.91,69.85 0 top
C12  50.8,60.96 180 top
C13  40.64,43.18 90 top
C14  43.18,43.18 90 top
C15  49.53,50.8 180 top
C16  41.91,49.53 0 top
C17  41.91,52.07 0 top
C18  50.8,43.18 180 top
C19  20.32,50.8 270 top
C21  25.4,77.47 270 top
D1  8.89,71.12 270 top
D2  87.12,59.69 0 bottom
D3  87.12,62.23 0 bottom
D4  116.33,19.05 180 bottom
D5  109.73,72.39 180 bottom
D6  109.73,69.85 180 bottom
D7  104.9,59.69 0 top
D8  104.9,57.15 0 top
D9  109.47,16.51 180 bottom
D10  109.47,13.97 180 bottom
D11  109.47,11.18 180 bottom
D12  116.59,29.21 0 bottom
D13  116.59,26.67 0 bottom
D14  109.47,29.21 180 bottom
D15  109.47,26.67 180 bottom
D16  109.47,24.13 180 bottom
D17  109.47,19.05 180 bottom
D18  109.47,21.59 180 bottom
D19  80.52,62.23 180 bottom
D20  80.52,72.39 180 bottom
D21  80.52,69.85 180 bottom
D22  80.52,29.21 180 bottom
D23  87.12,72.39 0 bottom
D24  87.12,69.85 0 bottom
D25  80.52,64.77 180 bottom
D26  87.12,67.31 0 bottom
D27  80.52,26.67 180 bottom
D28  87.12,64.77 0 bottom
D29  80.52,24.13 180 bottom
D30  80.52,21.59 180 bottom
D31  80.52,19.05 180 bottom
D32  80.52,16.51 180 bottom
D33  80.52,13.97 180 bottom
D34  80.52,11.43 180 bottom
D35  80.52,67.31 180 bottom
D36  116.33,16.51 180 bottom
D37  116.33,13.97 180 bottom
D38  116.33,11.43 180 bottom
J1  54.61,81.28 0 top
J4  40.89,9.14 0 top
J5  83.82,21.59 270 top
J6  113.03,64.77 270 top
J7  83.82,64.77 270 top
J8  113.03,21.59 270 top
L2  36.83,66.04 90 top
L3  36.83,48.26 90 top
PAD1  4.32,38.61 0 top
PAD2  4.32,35.31 0 top
PAD3  4.32,32 0 top
PAD4  4.32,28.7 0 top
PAD5  4.32,25.4 0 top
PAD6  4.32,22.1 0 top
PAD7  7.62,38.61 0 top
PAD8  7.62,35.31 0 top
PAD9  7.62,32 0 top
PAD10  7.62,28.7 0 top
PAD11  10.92,28.7 0 top
PAD12  7.62,25.4 0 top
PAD13  10.92,38.61 0 top
PAD14  7.62,22.1 0 top
PAD15  10.92,35.31 0 top
PAD16  7.62,18.8 0 top
PAD17  10.92,32 0 top
PAD18  10.92,18.8 0 top
PAD19  10.92,25.4 0 top
PAD20  14.22,38.61 0 top
PAD21  10.92,22.1 0 top
PAD22  14.22,35.31 0 top
PAD23  4.32,18.8 0 top
PAD24  14.22,32 0 top
PAD25  14.22,28.7 0 top
PAD26  14.22,25.4 0 top
PAD27  14.22,22.1 0 top
PAD28  14.22,18.8 0 top
PAD29  17.53,22.1 0 top
PAD30  17.53,35.31 0 top
PAD31  17.53,18.8 0 top
PAD32  17.53,32 0 top
PAD33  20.83,38.61 0 top
PAD34  17.53,28.7 0 top
PAD35  17.53,38.61 0 top
PAD36  17.53,25.4 0 top
PAD37  20.83,35.31 0 top
PAD38  20.83,18.8 0 top
PAD39  20.83,32 0 top
PAD41  20.83,28.7 0 top
PAD43  20.83,25.4 0 top
PAD45  20.83,22.1 0 top
Q1  22.86,66.04 270 top
R1  29.21,54.61 180 top
R2  29.21,57.15 180 top
R5  19.05,57.15 0 top
R6  29.21,49.53 0 top
R7  29.21,52.07 0 top
R8  53.34,64.77 90 top
R9  50.8,58.42 0 top
R10  50.8,64.77 270 top
R12  5.08,72.39 270 top
R13  53.34,46.99 90 top
R14  50.8,40.64 0 top
R15  50.8,46.99 270 top
R16  7.62,64.77 90 top
R17  10.16,64.77 270 top
S1  6.35,56.39 90 top
SW1  62.23,55.88 270 top
TP1  98.04,75.44 0 top
TP2  104.14,43.43 90 top
TP3  98.3,43.43 270 top
U1  24.13,53.34 270 top
U2  46.99,64.77 270 top
U3  46.99,46.99 270 top
U$9  17.78,80.01 180 top
X5  26.67,44.45 180 top

### Tracks (layer width: path | path; a pad name or v marks a point on that pad's centre or on a via)
3.3V  (via drill 0.35)
  Top 0.2: C19.2
  Top 0.254: v104.14,39.37 102.11,37.34 v73.41,37.34
  Top 0.305: U1.4 C19.2 | R7.2 R6.2 30.48,49.21 30.48,48.26 v29.21,46.99 24.38,46.99 21.52,49.85 C19.2 | v104.14,39.37 TP2.TP-1 | J8.1 v107.19,30.48
  Bottom 0.254: v29.21,46.99 29.21,42.67 34.54,37.34 v73.41,37.34
  Bottom 0.305: v104.14,39.37 104.14,33.53 v107.19,30.48 107.19,29.97 107.95,29.21 D14.1
5V  (via drill 0.35)
  Top 0.152: R13.2 53.65,48.24
  Top 0.305: TP2.TP-2 104.14,51.31 108.71,55.88
  Top 0.508: C17.1 v39.37,52.07 39.37,52.98 41.31,54.91 51.1,54.91 53.34,52.68 R13.2 | C16.1 v39.37,49.53 | L3.2 38.22,50.8 v39.37,50.8
  Top 0.61: D8.1 103.38,57.15 102.11,55.88 | J7.16 84.84,55.88 83.57,54.61 v75.95,54.61 74.42,56.13 v74.42,61.47
  Top 1.016: J7.16 v93.98,55.88 102.11,55.88 108.71,55.88 J6.15
  Bottom 0.61: v75.95,54.61 73.66,54.61 71.12,52.07 71.12,47.24 | J1.2 64.36,85.6 72.64,85.6 74.42,83.82 v74.42,61.47
  pour Bottom (isolate 0.305): 40.64,48.26 40.64,53.34 41.91,54.61 53.34,54.61 62.23,45.72 63.5,45.72 72.39,45.72 72.39,48.26 62.23,48.26 54.61,55.88 39.37,55.88 38.1,54.61 38.1,48.26
12V  (via drill 0.35)
  Top 0.305: TP3.TP-1 98.3,52.07 v96.52,53.85
  Top 0.508: L2.2 38.22,68.58 v39.37,68.58 | C10.1 v39.37,67.31 | C11.1 v39.37,69.85 39.37,71.12 40.64,72.39 50.8,72.39 53.34,69.85 R8.2
  Top 0.61: D7.1 103.38,59.69 102.11,58.42 | J7.14 84.84,58.42 83.57,59.69 v75.95,59.69
  Top 1.016: J7.14 v96.52,58.42 102.11,58.42 J6.13
  Bottom 0.305: v96.52,53.85 v96.52,58.42
  Bottom 0.61: v75.95,59.69 73.66,59.69 71.12,62.23 71.12,64.77 | J1.8 43.43,81.11 43.43,72.9
  pour Bottom (isolate 0.305): 40.64,66.04 40.64,71.12 41.91,72.39 53.34,72.39 62.23,63.5 63.5,63.5 72.39,63.5 72.39,66.04 62.23,66.04 54.61,73.66 39.37,73.66 38.1,72.39 38.1,66.04
CANH  (via drill 0.35)
  Top 0.254: v106.68,73.66 J6.1 | 96.14,65.91 v96.01,65.79
  Top 0.305: J7.10 v89.92,63.5 93.73,63.5 v96.01,65.79 | 96.14,65.91 TP1.TP-1 94.61,76.96 62.99,76.96 J1.10
  Bottom 0.254: 89.92,63.25 v89.92,63.5 | 106.68,73.41 v106.68,73.66
  Bottom 0.305: v96.01,65.79 103.89,73.66 v106.68,73.66 | D3.1 88.9,62.23 89.92,63.25 | D5.1 107.7,72.39 106.68,73.41
CANL  (via drill 0.35)
  Top 0.254: v106.68,71.12 J6.3 | 99.95,65.91 v99.82,65.79 | 100.08,75.56 TP1.TP-2
  Top 0.305: J7.12 v89.92,60.96 95,60.96 v99.82,65.79 | TP1.TP-2 99.95,65.91 | J1.9 64.97,77.72 92.2,77.72 94.49,80.01 98.55,80.01 100.08,78.49 100.08,75.56
  Bottom 0.254: v89.92,60.96 89.92,60.71 | 106.68,70.87 v106.68,71.12
  Bottom 0.305: v106.68,71.12 105.16,71.12 v99.82,65.79 | D2.1 88.9,59.69 89.92,60.71 | D6.1 107.7,69.85 106.68,70.87
DROP_A  (via drill 0.35)
  Top 0.254: J8.11 v106.93,17.78 105.41,16.26 105.41,9.4 101.85,5.84 58,5.84 J4.14
  Bottom 0.305: D9.1 107.95,16.51 106.93,17.53 v106.93,17.78
DROP_B  (via drill 0.35)
  Top 0.254: J8.13 v106.93,15.24 106.17,14.48 106.17,9.14 102.11,5.08 55.99,5.08 J4.15
  Bottom 0.305: D10.1 107.95,13.97 106.93,14.99 v106.93,15.24
DROP_C  (via drill 0.35)
  Top 0.254: J8.15 v106.86,12.7 106.86,8.82 102.36,4.32 53.99,4.32 J4.16
  Bottom 0.305: v106.86,12.7 106.86,12.45 108.13,11.18 D11.1
EN_5V  (via drill 0.35)
  Top 0.305: U3.5 v49.53,46.99 | v55.88,46.99 58.42,49.53 SW1.2
  Bottom 0.305: v49.53,46.99 v55.88,46.99
EN_12V  (via drill 0.35)
  Top 0.2: U2.5 v49.53,64.77
  Bottom 0.2: v49.53,64.77 54.61,64.77 58.42,60.96 SW1.1
GND  (via drill 0.35)
  Top 0.152: 43.18,49.53 C16.2
  Top 0.254: 106.93,60.71 v106.93,60.96 J6.11 J6.9 | J7.15 J7.13
  Top 0.305: U1.3 21.58,53.02 C19.1 18.1,51.75 v17.78,52.07 | R2.1 v31.75,57.15 | R1.1 v31.75,54.61 | J7.13 v83.06,58.42
  Top 0.508: U3.1 45.64,49.61 v44.45,50.8 43.18,49.53 | R15.1 52.07,49.21 52.07,52.07 50.8,53.34 44.13,53.34 C17.2 v44.45,52.07 | C13.2 v40.64,45.72 | C14.2 v43.18,45.72 | C11.2 v44.45,69.85 45.72,71.12 50.8,71.12 52.07,69.85 52.07,66.99 R10.1 | C10.2 44.13,68.58 v44.45,68.58 45.64,67.39 U2.1 | C7.2 v40.64,63.5 | C8.2 v43.18,63.5 | SW1.4 SW1.3 66.04,52.07 v64.77,50.8 | S1.2 v10.16,56.39
  Top 0.61: D7.2 105.92,59.69 106.93,60.71 | D8.2 v106.93,57.15 | J1.1 65.89,82.7 67.31,81.28 v67.31,79.76
  Top 1.016: R12.1 v5.08,74.93 5.08,78.81 U$9.- | C21.- 23.05,83.82 v22.86,83.82 v21.59,83.82
  Bottom 0.254: D5.2 111.51,72.39 | D6.2 111.51,69.85
  Bottom 0.61: v106.93,57.15 v106.93,60.96
  other vias: 41.91,45.72 41.91,63.5
  pour Bottom (isolate 0.305, rank 6): 0.76,88.39 119.63,88.39 119.89,88.14 119.89,0.76 0.76,0.76 0.51,0.51 0.51,88.39
GND1  (3 unrouted)
M1_BK  (via drill 0.35)
  Top 0.254: J7.3 v77.72,71.12 62.08,71.12 54.61,78.59 J1.12
  Bottom 0.254: D21.1 78.74,69.85 77.72,70.87 v77.72,71.12
M1_FR  (via drill 0.35)
  Top 0.254: J7.1 v77.72,73.66 61.77,73.66 57.35,78.08 J1.11
  Bottom 0.254: D20.1 78.74,72.39 77.72,73.41 v77.72,73.66
M1_PG  (via drill 0.35)
  Top 0.254: J7.7 v77.72,66.04 62.44,66.04 49.13,79.35 J1.14
  Bottom 0.254: D25.1 78.74,64.77 77.72,65.79 v77.72,66.04
M1_SV  (via drill 0.35)
  Top 0.254: J7.5 v77.72,68.58 62.39,68.58 51.87,79.1 J1.13
  Bottom 0.254: v77.72,68.58 77.72,68.33 78.74,67.31 D35.1
M2_BK  (via drill 0.35)
  Top 0.254: J1.4 55.98,78.39 61.98,72.39 84.58,72.39 85.85,71.12 J7.4 v89.92,71.12
  Bottom 0.254: D24.1 88.89,69.85 89.92,70.87 v89.92,71.12
M2_FR  (via drill 0.35)
  Top 0.254: J1.3 58.72,77.81 61.6,74.93 84.58,74.93 85.85,73.66 J7.2 v89.92,73.66
  Bottom 0.254: D23.1 88.9,72.39 89.92,73.41 v89.92,73.66
M2_PG  (via drill 0.35)
  Top 0.254: J1.6 50.5,79.29 62.48,67.31 84.58,67.31 85.85,66.04 J7.8 v89.92,66.04
  Bottom 0.254: D28.1 88.89,64.77 89.92,65.79 v89.92,66.04
M2_SV  (via drill 0.35)
  Top 0.254: J1.5 53.24,78.84 62.23,69.85 84.58,69.85 85.85,68.58 J7.6 v89.92,68.58
  Bottom 0.254: D26.1 88.89,67.31 89.92,68.33 v89.92,68.58
M3_BK  (via drill 0.35)
  Top 0.254: J5.3 v77.72,27.94 71.63,27.94 64.52,20.83 37.34,20.83 27.08,10.57 J4.12
  Bottom 0.254: D27.1 78.74,26.67 77.72,27.69 v77.72,27.94
M3_FR  (via drill 0.35)
  Top 0.254: J5.1 v77.72,30.48 73.15,30.48 64.26,21.59 35.31,21.59 J4.13
  Bottom 0.254: D22.1 78.74,29.21 77.72,30.23 v77.72,30.48
M3_PG  (via drill 0.35)
  Top 0.254: J4.10 41.43,19.41 65.19,19.41 68.65,22.86 v77.72,22.86 J5.7
  Bottom 0.254: D30.1 78.74,21.59 77.72,22.61 v77.72,22.86
M3_SV  (via drill 0.35)
  Top 0.254: J5.5 v77.72,25.4 70.1,25.4 64.77,20.07 39.32,20.07 J4.11
  Bottom 0.254: D29.1 78.74,24.13 77.72,25.15 v77.72,25.4
M4_BK  (via drill 0.35)
  Top 0.254: J4.8 45.34,17.78 v77.72,17.78 J5.11
  Bottom 0.254: D32.1 78.74,16.51 77.72,17.53 v77.72,17.78
M4_FR  (via drill 0.35)
  Top 0.254: J4.9 43.28,18.49 75.78,18.49 77.6,20.32 v77.72,20.32 J5.9
  Bottom 0.254: D31.1 78.74,19.05 77.72,20.07 v77.72,20.32
M4_PG  (via drill 0.35)
  Top 0.254: J5.15 v77.65,12.7 74.04,16.31 49.41,16.31 J4.6
  Bottom 0.254: D34.1 78.67,11.43 77.65,12.45 v77.65,12.7
M4_SV  (via drill 0.35)
  Top 0.254: J5.13 v77.72,15.24 77.65,15.24 75.87,17.02 47.35,17.02 J4.7
  Bottom 0.254: D33.1 78.74,13.97 77.72,14.99 v77.72,15.24
M_EN  (via drill 0.35)
  Top 0.254: J7.9 v77.72,63.5 62.75,63.5 J1.15 47.76,81.23 J1.7 | J4.17 46.43,9.11 J4.5
  Bottom 0.254: J4.5 68.38,32.51 72.9,32.51 77.72,37.34 v77.72,63.5 77.72,63.25 78.74,62.23 D19.1
N$3
  Top 0.305: U1.8 25.43,55.59 26.99,57.15 R2.2
N$6
  Top 0.305: R9.2 C12.1 53.34,62.55 R8.1
N$7  (1 unrouted)
  Top 0.305: R9.1 C12.2 49.85,62.31 U2.4
N$8
  Top 0.305: U1.7 27.32,53.66 R1.2
N$9
  Top 0.152: C9.1 50.48,67.86
  Top 0.305: 50.48,67.86 U2.6
N$10  (via drill 0.35)
  Top 0.152: L2.1 36.95,64.77
  Top 0.508: C9.2 v46.99,68.58 | U2.2 v44.45,64.77 36.95,64.77
  Bottom 0.508: v44.45,64.77 44.45,67.31 45.72,68.58 v46.99,68.58
N$11
  Top 0.305: R13.1 53.34,44.77 C18.1 R14.2
N$12
  Top 0.305: R14.1 C18.2 49.85,45.09 R15.2 U3.4
N$14
  Top 0.305: C15.1 49.53,49.85 49.53,48.26 49.21,47.94 U3.6
N$15  (via drill 0.35)
  Top 0.152: 36.95,46.99 L3.1
  Top 0.508: U3.2 v44.45,46.99 36.95,46.99 | v46.99,50.8 C15.2
  Bottom 0.508: v44.45,46.99 44.45,49.53 45.72,50.8 v46.99,50.8
N$16
  Top 0.508: R12.2 7.16,71.44 D1.1
N$17
  Top 0.508: R16.1 7.62,61.47 S1.3
N$18
  Top 0.152: 10.16,65.54 R17.1
  Top 0.508: Q1.1 12.76,68.32 R17.1 R16.2
N$19  (via drill 0.35)
  other vias: 41.91,40.64
N$50
  cutout Bottom: 2.03,41.4 2.03,16.26 23.11,16.26 23.11,41.4
SCL  (via drill 0.35)
  Top 0.254: v73.41,36.32 109.8,36.32 115.64,30.48 J8.2
  Top 0.305: U1.5 25.43,51.09 26.67,49.85 v26.67,49.53 R6.1 27.94,49.53 | J8.2 v119.13,30.48
  Bottom 0.254: v26.67,49.53 X5.1 28.19,43.93 28.19,42.16 34.04,36.32 v73.41,36.32
  Bottom 0.305: v119.13,30.48 119.13,29.97 118.36,29.21 D12.1
SDA  (via drill 0.35)
  Top 0.2: 25.94,53.02 U1.6
  Top 0.254: 115.67,27.94 108.3,35.31 v73.41,35.31
  Top 0.305: R7.1 v26.67,52.07 26.34,52.41 26.34,52.69 26.01,53.02 U1.6 | 115.67,27.94 J8.4 v119.13,27.94
  Bottom 0.254: v26.67,52.07 26.67,51.05 25.4,49.78 25.4,44.72 X5.2 27.18,42.94 27.18,41.66 33.53,35.31 v73.41,35.31
  Bottom 0.305: v119.13,27.94 119.13,27.43 118.36,26.67 D13.1
SP1  (via drill 0.35)
  Top 0.305: J8.10 114.55,20.32 v113.28,19.05 112.27,18.03 112.27,7.62 108.2,3.56 49.21,3.56 J4.18
  Bottom 0.305: D4.1 v113.28,19.05
SP2  (via drill 0.35)
  Top 0.305: J8.12 114.3,17.78 v113.03,16.51 113.03,7.11 108.71,2.79 47.21,2.79 J4.19
  Bottom 0.305: D36.1 v113.03,16.51
SP3  (via drill 0.35)
  Top 0.305: J8.14 114.81,15.24 v113.74,14.17 113.74,6.67 109.16,2.08 45.24,2.08 39.6,7.72 J4.20
  Bottom 0.305: D37.1 113.94,13.97 v113.74,14.17
SP4  (via drill 0.35)
  Top 0.305: J8.16 115.39,12.7 114.45,11.76 v114.45,11.43 114.45,6.23 109.6,1.37 43.09,1.37 J4.21
  Bottom 0.305: D38.1 v114.45,11.43
THER_A_SCL  (via drill 0.35)
  Top 0.254: J8.7 v107.19,22.86 92.46,8.13 76.96,8.13 71.63,13.46 57.63,13.46 J4.2
  Bottom 0.305: D18.1 107.95,21.59 107.19,22.35 v107.19,22.86
THER_A_SDA  (via drill 0.35)
  Top 0.254: J8.9 v106.93,20.32 105.92,20.32 92.96,7.37 76.71,7.37 71.48,12.6 59.54,12.6 J4.1
  Bottom 0.305: D17.1 107.7,19.05 106.93,19.81 v106.93,20.32
THER_B_SCL  (via drill 0.35)
  Top 0.254: J8.3 v107.19,27.94 104.65,25.4 104.65,22.86 91.44,9.65 77.47,9.65 72.14,14.99 53.62,14.99 J4.4
  Bottom 0.305: D15.1 107.95,26.67 107.19,27.43 v107.19,27.94
THER_B_SDA  (via drill 0.35)
  Top 0.254: J8.5 v107.19,25.4 105.41,23.62 105.41,22.35 91.95,8.89 77.22,8.89 71.88,14.22 55.63,14.22 J4.3
  Bottom 0.305: D16.1 107.95,24.13 107.19,24.89 v107.19,25.4
VIN  (via drill 0.35)
  Top 0.152: C14.1 43.18,41.91
  Top 0.508: C13.1 v40.64,40.64 | 43.18,41.91 v43.18,40.64 | U2.3 45.64,61.2 44.45,60.01 C8.1 v43.18,58.42 | C7.1 v40.64,58.42 | C14.1 44.77,42.23 45.72,43.18 45.72,45.96 U3.3
  Top 1.016: C21.+ 25.36,73.43 Q1.4 26.67,66.04 31.75,60.96 v34.29,60.96 v35.56,60.96
  other vias: 41.91,58.42
  pour Bottom (isolate 0.308): 33.53,61.98 44.7,61.98 44.7,57.4 37.34,57.4 35.81,57.4 34.8,56.39 34.8,43.69 35.81,42.67 45.97,42.67 46.99,41.66 46.99,40.39 45.97,39.37 34.8,39.37 32.51,41.66 32.51,42.42 32.51,60.96
VIN+  (via drill 0.35)
  Top 0.305: U1.1 22.06,55.08 21.85,55.3 R5.2
  Top 1.016: U$9.+ 15.24,78.05 v15.24,74.93 v15.24,73.66 | R5.2 21.59,57.41 v21.59,59.69 v20.32,60.96
  Bottom 1.016: v15.24,73.66 20.32,68.58 v20.32,60.96
VIN-  (via drill 0.35)  (1 unrouted)
  Top 0.305: U1.2 19.73,53.66 R5.1
  Top 0.508: D1.3 v11.43,71.12 v12.7,71.12
  Top 1.016: R5.1 16.51,57.41 16.51,62.21 Q1.3 | R17.2 12.38,63.82 v12.7,63.5
  other vias: 16.51,62.23
  pour Bottom (isolate 0.305): 10.16,72.39 13.97,72.39 17.78,68.58 17.78,60.96 10.16,60.96

### Text on the board
tNames: GND | VIN+ | Motor Brd | CANH | CANL | Sensors/Comms / Brd | M1_FR | M2_FR | CANH | M1_BK | M2_BK | CANL | VIN | M1_SV | M2_SV | M1_PG | M2_PG | M_EN | CANH | CANL | EN_6/12V | 5V | VIN- | EN_5V | B_SCL | 6/12V | 5V | B_SDA | A | E | G | GND | 3V3 | 1 | Motor Brd | B_SCL | B_SDA | Sensors/Comms / Brd | NUSSEDS DARPASubT | VER 1.1 | M3_FR | 3V3 | Power Distribution Brd | M3_BK | THER_B_SCL | Left Daughter Brd | Motor | M3_SV | THER_B_SDA | 5 | Right Daughter Brd | Sensors, Comms | M3_PG | THER_A_SCL | M4_FR | THER_A_SDA | 7 | M4_BK | DROP_A | M4_SV | DROP_B | M4_PG | DROP_C